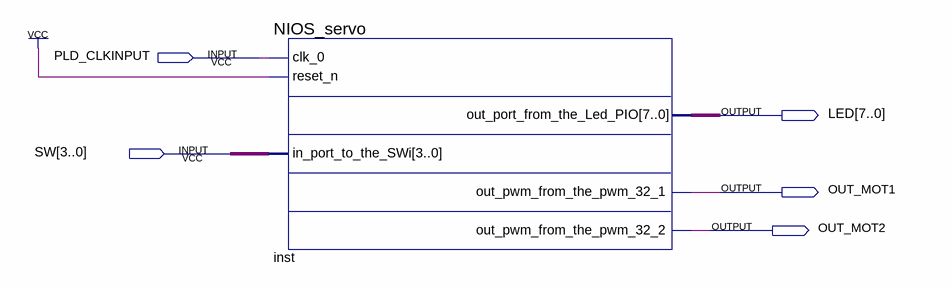
[diagram p0: schematic sheet]
// Quartus schematic block_servo.bdf as structural Verilog: 1 symbols, 5 pins
module block_servo (
  input  PLD_CLKINPUT,
  input  [3:0] SW,
  output [7:0] LED,
  output OUT_MOT1,
  output OUT_MOT2
);

  NIOS_servo inst (
    .clk_0(PLD_CLKINPUT), .reset_n(1'b1), .in_port_to_the_SWi(SW), .out_port_from_the_Led_PIO(LED),
    .out_pwm_from_the_pwm_32_1(OUT_MOT1), .out_pwm_from_the_pwm_32_2(OUT_MOT2));
endmodule
